# EAGLE design eeArm_Breakout (EAGLE 7.2.0)
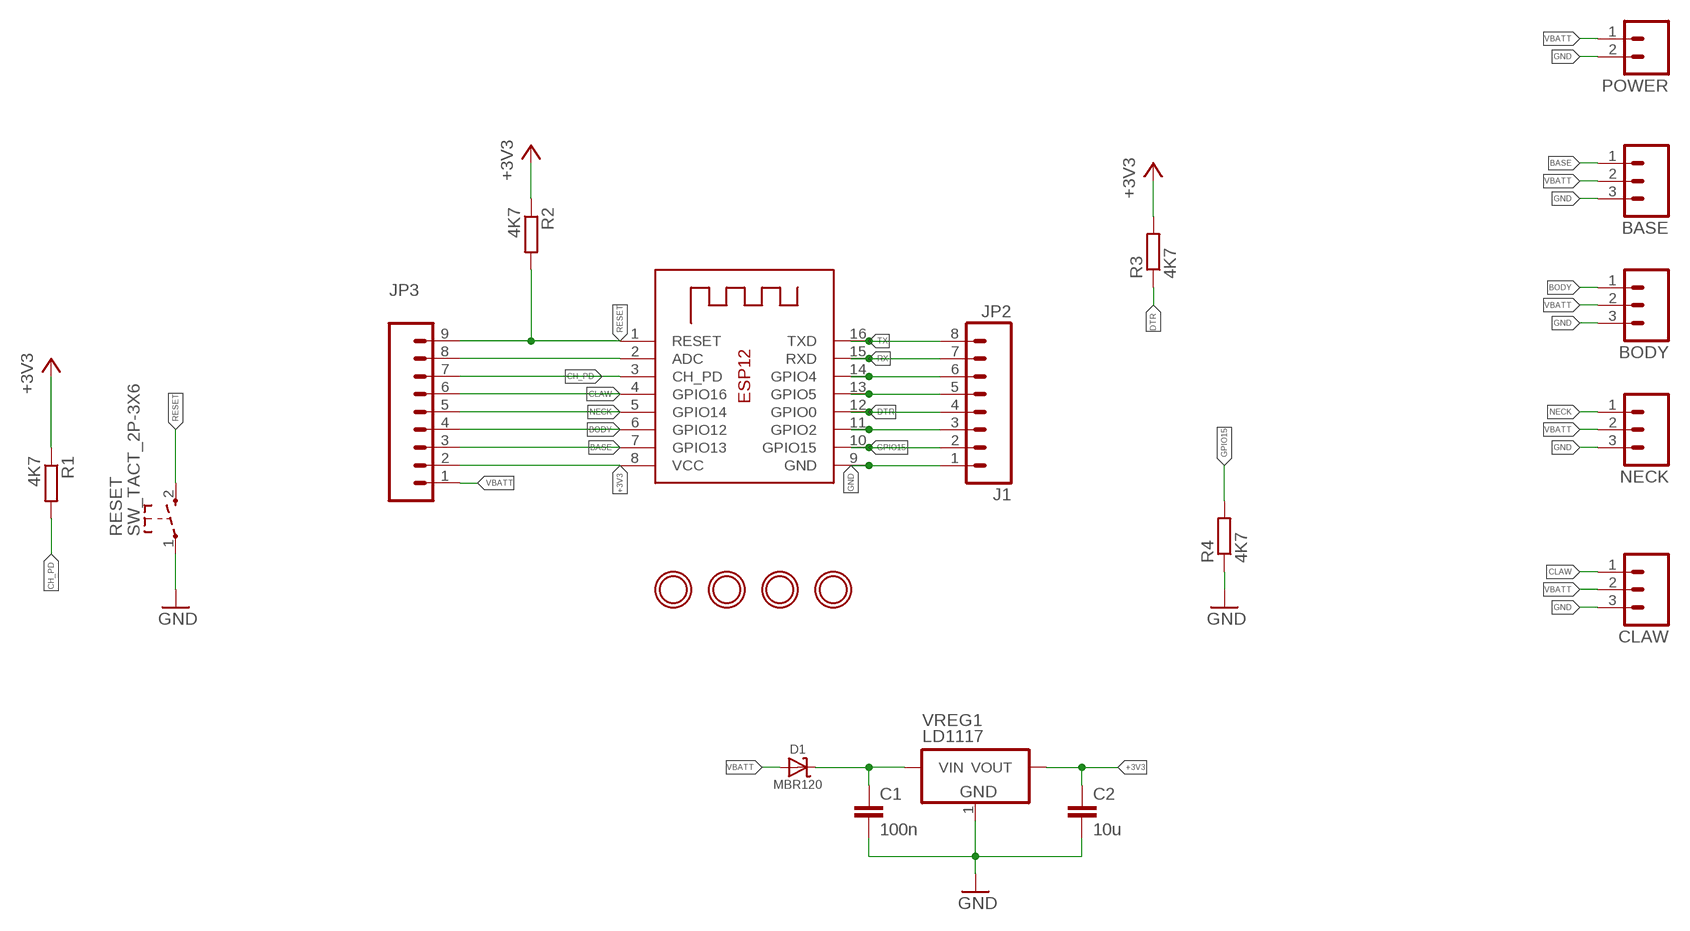
[diagram p0: schematic, sheet 1]

## Parts
BASE  M03LOCK  [1X03_LOCK]
BODY  M03LOCK  [1X03_LOCK]
C1  100n  C-EUC0805  [C0805]
C2  10u  C-EUC0805  [C0805]
CLAW  M03LOCK  [1X03_LOCK]
D1  MBR120  DIODE-SCHOTTKYSOD-123  [SOD-123]
JP2  J1  M08LOCK  [1X08_LOCK]
JP3  M09LOCK  [1X09_LOCK]
NECK  M03LOCK  [1X03_LOCK]
POWER  M02LOCK  [1X02_LOCK]
R1  4K7  R-EU_R0805  [R0805]
R2  4K7  R-EU_R0805  [R0805]
R3  4K7  R-EU_R0805  [R0805]
R4  4K7  R-EU_R0805  [R0805]
RESET  SW_TACT_2P-3X6  [SW_TACT_3X6]
U$6  MOUNTINGHOLE2.0  [MOUNTINGHOLE_2.0_PLATED]
U$7  MOUNTINGHOLE2.0  [MOUNTINGHOLE_2.0_PLATED]
U$8  MOUNTINGHOLE2.0  [MOUNTINGHOLE_2.0_PLATED]
U$9  MOUNTINGHOLE2.0  [MOUNTINGHOLE_2.0_PLATED]
VREG1  LD1117  VREG_3PINS-SOT-223  [SOT-223]
X1  ESP8266  ESP-12X  [ESP-12-NOPLACE]

## Nets
+3V3: C2.1 JP3.2 R1.1 R2.1 R3.2 VREG1.2(VOUT) X1.8(VCC)
ADC: JP3.8 X1.2(ADC)
BASE: BASE.1 JP3.3 X1.7(GPIO13)
BODY: BODY.1 JP3.4 X1.6(GPIO12)
CH_PD: JP3.7 R1.2 X1.3(CH_PD)
CLAW: CLAW.1 JP3.6 X1.4(GPIO16)
DTR: JP2.4 R3.1 X1.12(GPIO0)
GND: BASE.3 BODY.3 C1.2 C2.2 CLAW.3 JP2.1 NECK.3 POWER.2 R4.1 RESET.1 VREG1.1(GND) X1.9(GND)
GPIO2: JP2.3 X1.11(GPIO2)
GPIO4: JP2.6 X1.14(GPIO4)
GPIO5: JP2.5 X1.13(GPIO5)
GPIO15: JP2.2 R4.2 X1.10(GPIO15)
NECK: JP3.5 NECK.1 X1.5(GPIO14)
RESET: JP3.9 R2.2 RESET.2 X1.1(RESET)
RX: JP2.7 X1.15(RXD)
TX: JP2.8 X1.16(TXD)
VBATT: BASE.2 BODY.2 CLAW.2 D1.A JP3.1 NECK.2 POWER.1
VIN: C1.1 D1.C VREG1.3(VIN)

## Library data of the parts
BASE BODY CLAW NECK = SparkFun-Connectors:M03: Header 3 Standard 3-pin 0.1" header. Use with straight break away headers (SKU : PRT-00116), right angle break away headers (PRT-00553), swiss pins (PRT-00743), machine pins (PRT-00117), and female headers (PRT-00115). Molex polarized connector foot print use with SKU : PRT-08232 with associated crimp pins and housings.
C1 C2 = resistor:C-EU: CAPACITOR, European symbol
D1 = microbuilder:DIODE-SCHOTTKY
JP2 = SparkFun-Connectors:M08: Header 8 Standard 8-pin 0.1" header. Use with straight break away headers (SKU : PRT-00116), right angle break away headers (PRT-00553), swiss pins (PRT-00743), machine pins (PRT-00117), and female headers (PRT-00115).
JP3 = SparkFun-Connectors:M09: Header 9 Standard 9-pin 0.1" header. Use with straight break away headers (SKU : PRT-00116), right angle break away headers (PRT-00553), swiss pins (PRT-00743), machine pins (PRT-00117), and female headers (PRT-00115).
POWER = SparkFun-Connectors:M02: Standard 2-pin 0.1" header. Use with - straight break away headers ( PRT-00116) - right angle break away headers (PRT-00553) - swiss pins (PRT-00743) - machine pins (PRT-00117) - female headers (PRT-00115) Molex polarized connector foot print use with: PRT-08233 with associated crimp pins and housings. 2.54_SCREWTERM for use with PRT-10571. 3.5mm Screw Terminal footprints for PRT-08084 5mm Screw Terminal footprints for use with PRT-08432
R1-R4 = resistor:R-EU_: RESISTOR, European symbol
RESET = Gwa's Parts:SW_TACT_2P
U$6-U$9 = microbuilder:MOUNTINGHOLE: Mounting Hole For #2 screws (0.086"/2.18mm width, 0.094"/2.4mm hole) use 2.5mm; BOM: EXCLUDE
VREG1 = dp_devices:VREG_3PINS: Various 3 pin voltage regulators in different packages Double check the right pinout for the right part
X1 = Gwa's Parts:ESP-12

## Board
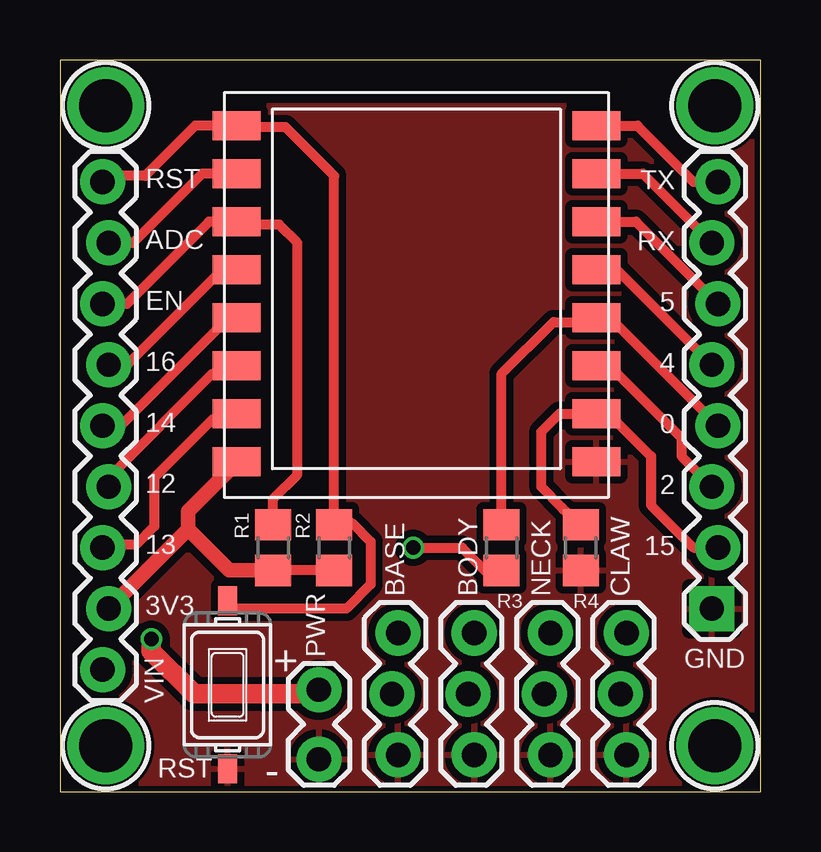
[diagram p1: board, top side]
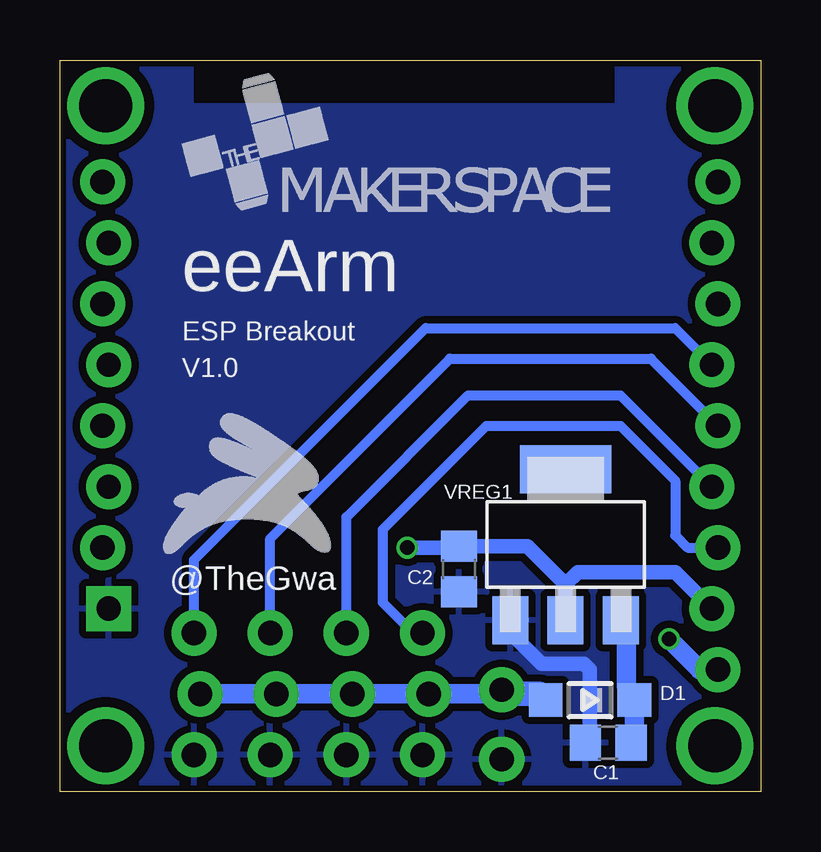
[diagram p2: board, bottom side, seen from below]

Size 29.21 x 30.48 mm. Coordinates in mm from the lower left corner, seen from the top.
Outline: 0,30.48 0,0 29.21,0 29.21,30.48 0,30.48
Copper layers (1*16): Top 0.035mm / dielectric 1.5mm / Bottom 0.035mm
Design rules "dirt_cheap_dirty_boards.v1 *": minimum track width 5mil, minimum drill 12mil, track to track 12mil, track to pad 12mil, pad to pad 12mil, via to via 12mil, smd to smd 0mil, copper to edge 10mil, drill to drill 10mil, minimum pad ring 10mil, minimum via ring 6mil, stop-mask expansion 2mil, vias tented up to drill 25mil, thermal gap 12mil
tRestrict: area 6.1,28.7 to 23.6,30.5
bRestrict: area 6.1,28.7 to 23.6,30.5

### Footprints (pad centres in the part's own frame; a part is rotated, then mirrored left to right if it is on the bottom)
1X03_LOCK = drill 1.016 pad 1.88: 1 0,0.127; 2 2.54,-0.127; 3 5.08,0.127
C0805 = smd 1.3 x 1.5: 1 -0.95,0; 2 0.95,0
SOD-123 = smd 1.4 x 1.4: A 1.85,0; C -1.85,0
1X08_LOCK = drill 1.016 pad 1.88 square: 1 0,0.127 | drill 1.016 pad 1.88: 2 2.54,-0.127; 3 5.08,0.127; 4 7.62,-0.127; 5 10.16,0.127; 6 12.7,-0.127; 7 15.24,0.127; 8 17.78,-0.127
1X09_LOCK = drill 1.016 pad 1.88: 1 0,0.127; 2 2.54,-0.127; 3 5.08,0.127; 4 7.62,-0.127; 5 10.16,0.127; 6 12.7,-0.127; 7 15.24,0.127; 8 17.78,-0.127; 9 20.32,0.127
1X02_LOCK = drill 1.016 pad 1.88: 1 -0.178,0; 2 2.718,0
R0805 = smd 1.3 x 1.5: 1 -0.95,0; 2 0.95,0
SW_TACT_3X6 = smd 1.2 x 0.8: 1 -3.5,0; 2 3.5,0
MOUNTINGHOLE_2.0_PLATED = drill 2.2 pad 3: P$1 0,0
SOT-223 = smd 1.5 x 2: 1 -2.3,-3.15; 2 0,-3.15; 3 2.3,-3.15 | smd 3.8 x 2: 4 0,3.15
ESP-12-NOPLACE = smd 2 x 1.2: 1 -7.5,4.5; 2 -7.5,2.5; 3 -7.5,0.5; 4 -7.5,-1.5; 5 -7.5,-3.5; 6 -7.5,-5.5; 7 -7.5,-7.5; 8 -7.5,-9.5; 9 7.5,-9.5; 10 7.5,-7.5; 11 7.5,-5.5; 12 7.5,-3.5; 13 7.5,-1.5; 14 7.5,0.5; 15 7.5,2.5; 16 7.5,4.5

### Placement (x,y rotation side)
BASE  13.97,6.6 270 top
BODY  17.14,6.6 270 top
C1  6.35,2.03 180 bottom
C2  12.57,9.27 270 bottom
CLAW  23.5,6.6 270 top
D1  7.11,3.81 180 bottom
E$1  [MAKERSPACE_LOGO]  24.13,24.13 0 bottom
E$2  [GWAJA-LOGO-PLACE]  24.89,9.91 0 bottom
JP2  27.3,7.62 90 top
JP3  1.91,5.08 90 top
NECK  20.32,6.6 270 top
POWER  10.79,4.06 270 top
R1  8.89,10.16 90 top
R2  11.43,10.16 90 top
R3  18.41,10.16 270 top
R4  21.72,10.16 90 top
RESET  6.99,4.45 90 top
U$6  27.3,28.57 0 top
U$7  1.91,28.57 0 top
U$8  1.91,1.91 0 top
U$9  27.3,1.91 0 top
VREG1  8.13,10.29 0 bottom
X1  14.86,23.24 0 top

### Tracks (layer width: path | path; a pad name or v marks a point on that pad's centre or on a via)
+3V3  (via drill 0.6)
  Top 0.406: 8.82,9.14 R1.1 R2.1 | X1.8 7.36,13.71 | v14.73,10.16 16.76,10.16 17.78,9.14 18.35,9.14 R3.2
  Top 0.61: 7.36,13.71 5.33,11.68 5.33,10.92 | 5.33,10.92 JP3.2 | 5.33,10.92 7.05,9.21 R1.1
  Bottom 0.406: C2.1 12.64,10.22 12.7,10.16
  Bottom 0.61: C2.1 9.71,10.22 8.13,8.64 | 8.13,8.64 VREG1.2 | JP3.2 3.56,9.14 7.62,9.14 8.13,8.64 | 12.7,10.16 v14.73,10.16
ADC
  Top 0.406: X1.2 5.93,25.74 3.05,22.86 JP3.8
BASE
  Top 0.406: X1.7 7.11,15.74 | 7.11,15.74 7.11,15.75 | JP3.3 1.91,10.29 3.17,10.29 3.94,11.05 3.94,13.08 6.35,15.49 6.86,15.49 7.11,15.74
  Bottom 0.406: JP3.3 3.05,10.16 3.56,10.67 3.56,12.95 5.84,15.24 11.43,15.24 15.75,10.92 15.75,7.87 14.48,6.6 BASE.1
BODY
  Top 0.406: X1.6 7.07,17.74 6.73,17.4 6.35,17.4 2.03,13.08 JP3.4
  Bottom 0.406: JP3.4 5.84,16.51 12.19,16.51 17.27,11.43 BODY.1
CH_PD
  Top 0.406: JP3.7 2.79,20.32 6.21,23.74 X1.3 7.48,23.62 9.14,23.62 9.91,22.86 9.91,13.21 8.89,12.19 R1.2
CLAW
  Top 0.406: X1.4 6.75,21.74 2.79,17.78 JP3.6
  Bottom 0.406: JP3.6 3.56,19.3 13.97,19.3 23.62,9.65 CLAW.1
DTR
  Top 0.406: R3.1 18.41,17.4 20.57,19.56 22.18,19.56 X1.12 22.93,19.74 JP2.4
GND
  Bottom 0.61: VREG1.1 10.43,6.62 9.14,5.33 7.37,5.33 7.11,5.08 7.11,2.22 C1.2
  pour Top: 0,30.48 0,0 29.21,0 29.21,30.48
  pour Bottom: 0,30.48 0,0 29.21,0 29.21,30.48
GPIO2
  Top 0.406: X1.11 22.9,17.74 25.91,14.73 25.91,13.97 JP2.3
GPIO4
  Top 0.406: X1.14 24.01,23.74 JP2.6
GPIO5
  Top 0.406: X1.13 23.22,21.74 JP2.5
GPIO15
  Top 0.406: R4.2 20.95,11.81 20.07,12.7 20.07,14.99 20.83,15.75 X1.10 23.11,15.75 23.11,15.49 24.64,13.97 24.64,11.94 26.42,10.16 JP2.2
NECK
  Top 0.406: X1.5 7.04,19.74 2.54,15.24 JP3.5
  Bottom 0.406: JP3.5 4.57,18.03 12.95,18.03 20.45,10.54 NECK.1
RESET
  Top 0.406: JP3.9 2.03,25.65 3.56,25.65 5.64,27.74 X1.1 7.41,27.69 9.4,27.69 11.43,25.65 R2.2 11.5,11.18 12.19,11.18 12.95,10.41 12.95,8.64 11.94,7.62 7.31,7.62 RESET.2
RX
  Top 0.406: X1.15 24.3,25.74 JP2.7
TX
  Top 0.406: X1.16 24.07,27.74 26.42,25.4 JP2.8
VBATT  (via drill 0.6)
  Top 0.813: v3.81,6.35 3.81,5.84 5.59,4.06 10.62,4.06 POWER.1
  Bottom 0.406: 9.14,4.24 D1.A
  Bottom 0.813: CLAW.2 NECK.2 BODY.2 BASE.2 10.97,4.06 | JP3.1 2.54,5.08 v3.81,6.35
  Bottom 1.016: 10.97,4.06 10.92,4.06 | 10.92,4.06 9.22,4.06 D1.A | POWER.1 10.79,4.19 10.92,4.06
VIN
  Bottom 0.406: 5.59,4.06 D1.C 5.59,4.39 | 5.59,6.52 VREG1.3 | 5.26,2.3 C1.1
  Bottom 0.813: 5.59,6.52 5.59,4.39 | D1.C 5.26,2.3

### Text on the board
tPlace: TX | RST | ADC | RX | 5 | EN | 16 | 4 | 0 | 14 | 2 | 12 | R1 | R2 | 15 | 13 | BASE | BODY | R3 | NECK | R4 | CLAW | 3V3 | PWR | GND | + | VIN | - | RST
bPlace: eeArm | ESP Breakout | V1.0 | VREG1 | C2 | @TheGwa | D1 | C1